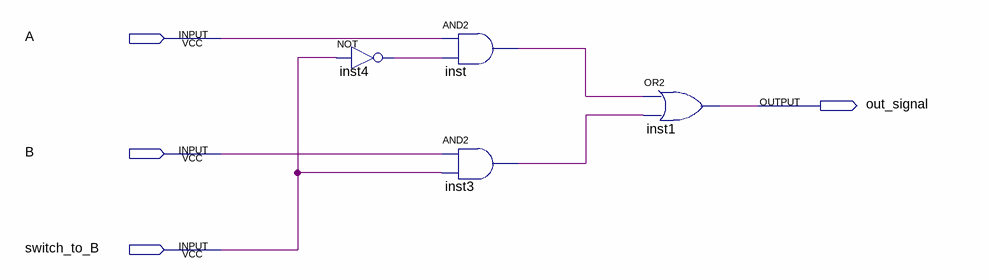
[diagram p0: schematic sheet]
// Quartus schematic input_selector.bdf as structural Verilog: 4 symbols, 4 pins
module input_selector (
  input  A,
  input  B,
  input  switch_to_B,
  output out_signal
);

  wire inst3_out, inst4_out, inst_out;

  not inst4 (inst4_out, switch_to_B);
  and inst (inst_out, A, inst4_out);
  and inst3 (inst3_out, B, switch_to_B);
  or inst1 (out_signal, inst_out, inst3_out);
endmodule
